# EAGLE design OptronV7_PCB (EAGLE 9.5.1)
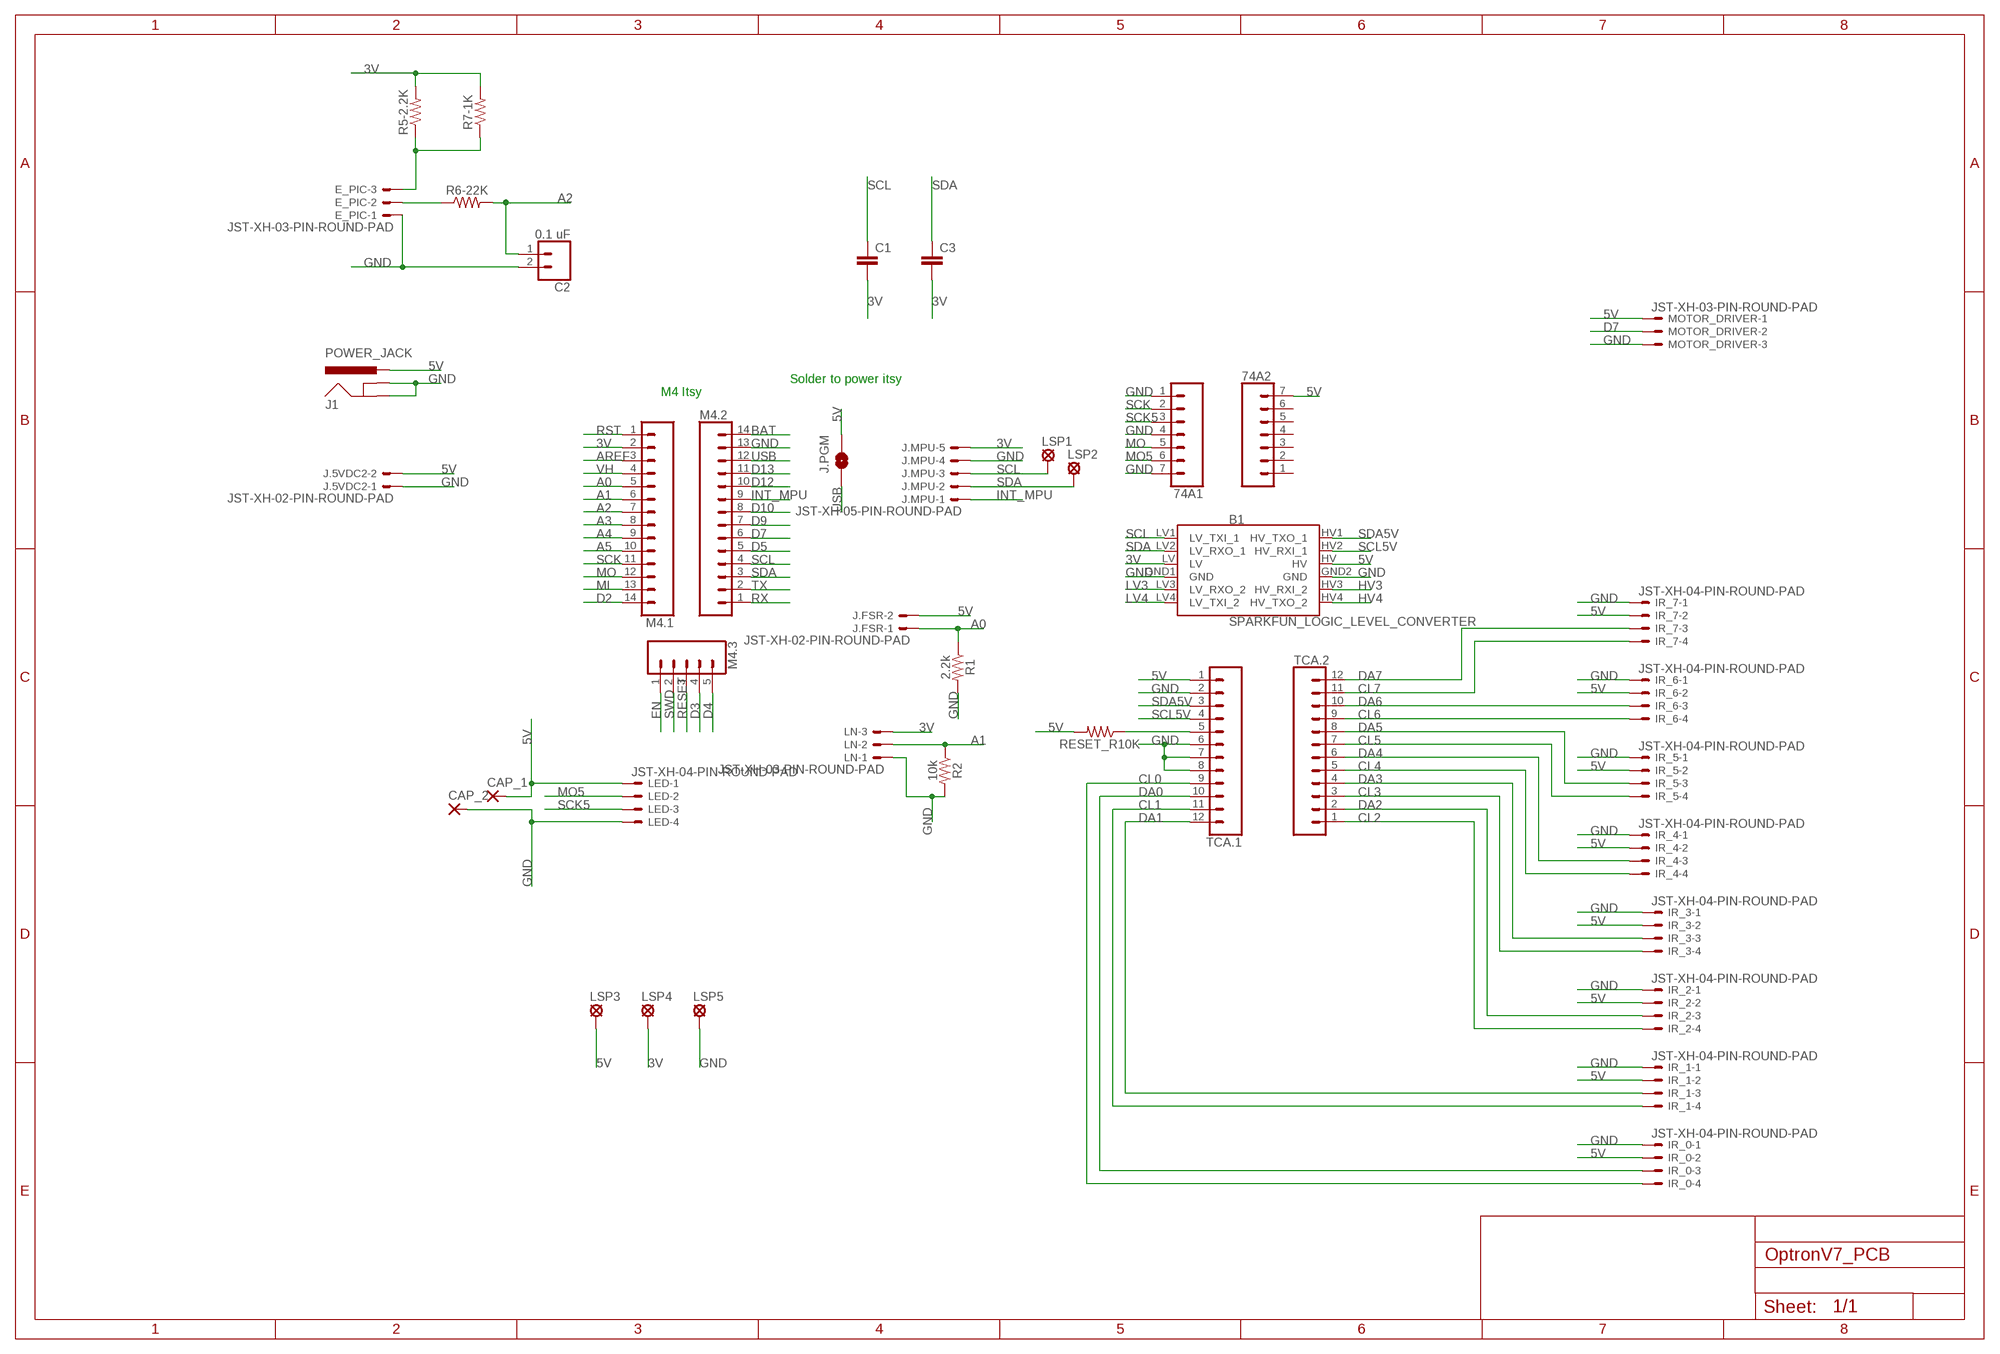
[diagram p0: schematic, sheet 1]

## Parts
74A1  CONN_07  [1X07]
74A2  CONN_07  [1X07]
B1  SPARKFUN_LOGIC_LEVEL_CONVERTER  [SPARKFUN_LOGIC_LEVEL_CONVERTER]
C1  C5/2.5  [C5B2.5]
C2  0.1 uF  CONN_02  [1X02]
C3  C5/2.5  [C5B2.5]
CAP_1  1,6/0,8  [1,6/0,8]
CAP_2  1,6/0,8  [1,6/0,8]
E_PIC  JST-XH-03-PIN-ROUND-PAD  [JST-XH-03-PACKAGE-ROUND-PAD]
IR_0  JST-XH-04-PIN-ROUND-PAD  [JST-XH-04-PACKAGE-ROUND-PAD]
IR_1  JST-XH-04-PIN-ROUND-PAD  [JST-XH-04-PACKAGE-ROUND-PAD]
IR_2  JST-XH-04-PIN-ROUND-PAD  [JST-XH-04-PACKAGE-ROUND-PAD]
IR_3  JST-XH-04-PIN-ROUND-PAD  [JST-XH-04-PACKAGE-ROUND-PAD]
IR_4  JST-XH-04-PIN-ROUND-PAD  [JST-XH-04-PACKAGE-ROUND-PAD]
IR_5  JST-XH-04-PIN-ROUND-PAD  [JST-XH-04-PACKAGE-ROUND-PAD]
IR_6  JST-XH-04-PIN-ROUND-PAD  [JST-XH-04-PACKAGE-ROUND-PAD]
IR_7  JST-XH-04-PIN-ROUND-PAD  [JST-XH-04-PACKAGE-ROUND-PAD]
J1  POWER_JACK  [POWER_JACK_PTH]
J.5VDC2  JST-XH-02-PIN-ROUND-PAD  [JST-XH-02-PACKAGE-ROUND-PAD]
J.FSR  JST-XH-02-PIN-ROUND-PAD  [JST-XH-02-PACKAGE-ROUND-PAD]
J.MPU  JST-XH-05-PIN-ROUND-PAD  [JST-XH-05-PACKAGE-ROUND-PAD]
J.PGM  JUMPER-SMT_2_NO_NO-SILK  [SMT-JUMPER_2_NO_NO-SILK]
LED  JST-XH-04-PIN-ROUND-PAD  [JST-XH-04-PACKAGE-ROUND-PAD]
LN  JST-XH-03-PIN-ROUND-PAD  [JST-XH-03-PACKAGE-ROUND-PAD]
LSP1  MCS08  [MCS08]
LSP2  MCS08  [MCS08]
LSP3  MCS08  [MCS08]
LSP4  MCS08  [MCS08]
LSP5  MCS08  [MCS08]
M4.1  CONN_14  [1X14]
M4.2  CONN_14  [1X14]
M4.3  CONN_05  [1X05]
MOTOR_DRIVER  JST-XH-03-PIN-ROUND-PAD  [JST-XH-03-PACKAGE-ROUND-PAD]
R1  2.2k  10KOHM-HORIZ-1/4W-5%  [AXIAL-0.3]
R2  10k  10KOHM-HORIZ-1/4W-5%  [AXIAL-0.3]
R5-2.2K  RESISTORAXIAL-0.3  [AXIAL-0.3]
R6-22K  RESISTORAXIAL-0.3  [AXIAL-0.3]
R7-1K  RESISTORAXIAL-0.3  [AXIAL-0.3]
RESET_R10K  RESISTORAXIAL-0.3  [AXIAL-0.3]
TCA.1  CONN_12  [1X12]
TCA.2  CONN_12  [1X12]

## Nets
3V: B1.LV C1.2 C3.2 J.MPU.5 LN.3 LSP4.MP M4.1.2 R5-2.2K.P$2 R7-1K.P$2
5V: 74A2.7 B1.HV CAP_1.1(P) IR_0.2 IR_1.2 IR_2.2 IR_3.2 IR_4.2 IR_5.2 IR_6.2 IR_7.2 J1.PWR J.5VDC2.2 J.FSR.2 J.PGM.2 LED.1 LSP3.MP MOTOR_DRIVER.1 RESET_R10K.P$2 TCA.1.1
A0: J.FSR.1 M4.1.5 R1.P$1
A1: LN.2 M4.1.6 R2.P$1
A2: C2.1 M4.1.7 R6-22K.P$2
A3: M4.1.8
A4: M4.1.9
A5: M4.1.10
AREF: M4.1.3
BAT: M4.2.14
CL0: IR_0.4 TCA.1.9
CL1: IR_1.4 TCA.1.11
CL2: IR_2.4 TCA.2.1
CL3: IR_3.4 TCA.2.3
CL4: IR_4.4 TCA.2.5
CL5: IR_5.4 TCA.2.7
CL6: IR_6.4 TCA.2.9
CL7: IR_7.4 TCA.2.11
D2: M4.1.14
D3: M4.3.4
D4: M4.3.5
D5: M4.2.5
D7: M4.2.6 MOTOR_DRIVER.2
D9: M4.2.7
D10: M4.2.8
D12: M4.2.10
D13: M4.2.11
DA0: IR_0.3 TCA.1.10
DA1: IR_1.3 TCA.1.12
DA2: IR_2.3 TCA.2.2
DA3: IR_3.3 TCA.2.4
DA4: IR_4.3 TCA.2.6
DA5: IR_5.3 TCA.2.8
DA6: IR_6.3 TCA.2.10
DA7: IR_7.3 TCA.2.12
EN: M4.3.1
GND: 74A1.1 74A1.4 74A1.7 B1.GND1(GND) B1.GND2(GND) C2.2 CAP_2.1(P) E_PIC.1 IR_0.1 IR_1.1 IR_2.1 IR_3.1 IR_4.1 IR_5.1 IR_6.1 IR_7.1 J1.GND J1.GNDBREAK J.5VDC2.1 J.MPU.4 LED.4 LN.1 LSP5.MP M4.2.13 MOTOR_DRIVER.3 R1.P$2 R2.P$2 TCA.1.2 TCA.1.6 TCA.1.7 TCA.1.8
HV3: B1.HV3(HV_RXI_2)
HV4: B1.HV4(HV_TXO_2)
INT_MPU: J.MPU.1 M4.2.9
LV3: B1.LV3(LV_RXO_2)
LV4: B1.LV4(LV_TXI_2)
MI: M4.1.13
MO: 74A1.5 M4.1.12
MO5: 74A1.6 LED.2
N$1: RESET_R10K.P$1 TCA.1.5
N$2: E_PIC.3 R5-2.2K.P$1 R7-1K.P$1
N$3: E_PIC.2 R6-22K.P$1
RESET: M4.3.3
RST: M4.1.1
RX: M4.2.1
SCK: 74A1.2 M4.1.11
SCK5: 74A1.3 LED.3
SCL: B1.LV1(LV_TXI_1) C1.1 J.MPU.3 LSP1.MP M4.2.4
SCL5V: B1.HV2(HV_RXI_1) TCA.1.4
SDA: B1.LV2(LV_RXO_1) C3.1 J.MPU.2 LSP2.MP M4.2.3
SDA5V: B1.HV1(HV_TXO_1) TCA.1.3
SWD: M4.3.2
TX: M4.2.2
USB: J.PGM.1 M4.2.12
VH: M4.1.4
Unconnected: 74A2.1 74A2.2 74A2.3 74A2.4 74A2.5 74A2.6

## Notes on the sheet
- Solder to power itsy
- M4 Itsy

## Library data of the parts
74A1 74A2 = SparkFun-Connectors:CONN_07: Multi connection point. Often used as Generic Header-pin footprint for 0.1 inch spaced/style header connections On any of the 0.1 inch spaced packages, you can populate with these: Break Away Headers - Straight <https://www.sparkfun.com/products/116> (PRT-00116) Break Away Male Headers - Right Angle <https://www.sparkfun.com/products/553> (PRT-00553) Female Headers <https://www.sparkfun.com/products/115> (PRT-00115) Break Away Headers - Machine Pin <https://www.sparkfun.com/products/117> (PRT-00117) Break Away Female Headers - Swiss Machine Pin <https://www.sparkfun.com/products/743> (PRT-00743) For SCREWTERMINALS and SPRING TERMINALS visit here: Screw Terimnals on SparkFun.com <https://www.sparkfun.com/search/results?term=Screw+Terminals> (5mm/3.5mm/2.54mm spacing) This device is also useful as a general connection point to wire up your design to another part of your project. Our various solder wires solder well into these plated through hole pads. Hook-Up Wire - Assortment (Stranded, 22 AWG) <https://www.sparkfun.com/products/11375> (PRT-11375) Hook-Up Wire - Assortment (Solid Core, 22 AWG) <https://www.sparkfun.com/products/11367> (PRT-11367) View the entire wire category on our website here <https://www.sparkfun.com/categories/141> Special notes: Molex polarized connector foot print use with SKU : PRT-08231 with associated crimp pins and housings. 1MM SMD Version SKU: PRT-10208 NOTES ON THE VARIANTS LOCK and LOCK_LONGPADS... This footprint was designed to help hold the alignment of a through-hole component (i.e. 6-pin header) while soldering it into place. You may notice that each hole has been shifted either up or down by 0.005 of an inch from it's more standard position (which is a perfectly straight line). This slight alteration caused the pins (the squares in the middle) to touch the edges of the holes. Because they are alternating, it causes a "brace" to hold the component in place. 0.005 has proven to be the perfect amount of "off-center" position when using our standard breakaway headers. Although looks a little odd when you look at the bare footprint, once you have a header in there, the alteration is very hard to notice. Also,if you push a header all the way into place, it is covered up entirely on the bottom side.
B1 = SparkFun-Boards:SPARKFUN_LOGIC_LEVEL_CONVERTER: SparkFun Logic Level Converter -Bi-Directional This is the mechnical outline for the 3.3V - 5V bi directional logic level converter. *Note, the "LOCK" Package has the header pins staggered by an offset of 5 mils (off center line), so that when you slide a row of standard 0.1" headers into the PTH pads, it will hold position vertically. See the follwing turorial for more information on this type of special footprints: Sneaky Footprints <https://www.sparkfun.com/tutorials/114> SparkFun Products: SparkFun Logic Level Converter - Bi-Directional <https://www.sparkfun.com/products/12009>
C1 C3 = capacitor-wima:C: CAPACITOR naming: grid - package width
C2 = SparkFun-Connectors:CONN_02: Multi connection point. Often used as Generic Header-pin footprint for 0.1 inch spaced/style header connections On any of the 0.1 inch spaced packages, you can populate with these: Break Away Headers - Straight <https://www.sparkfun.com/products/116> (PRT-00116) Break Away Male Headers - Right Angle <https://www.sparkfun.com/products/553> (PRT-00553) Female Headers <https://www.sparkfun.com/products/115> (PRT-00115) Break Away Headers - Machine Pin <https://www.sparkfun.com/products/117> (PRT-00117) Break Away Female Headers - Swiss Machine Pin <https://www.sparkfun.com/products/743> (PRT-00743) For SCREWTERMINALS and SPRING TERMINALS visit here: Screw Terimnals on SparkFun.com <https://www.sparkfun.com/search/results?term=Screw+Terminals> (5mm/3.5mm/2.54mm spacing) This device is also useful as a general connection point to wire up your design to another part of your project. Our various solder wires solder well into these plated through hole pads. Hook-Up Wire - Assortment (Stranded, 22 AWG) <https://www.sparkfun.com/products/11375> (PRT-11375) Hook-Up Wire - Assortment (Solid Core, 22 AWG) <https://www.sparkfun.com/products/11367> (PRT-11367) View the entire wire category on our website here <https://www.sparkfun.com/categories/141> Special notes: Molex polarized connector foot print use with: PRT-08233 with associated crimp pins and housings. 2.54_SCREWTERM for use with PRT-10571. 3.5mm Screw Terminal footprints for PRT-08084 5mm Screw Terminal footprints for use with PRT-08432
CAP_1 CAP_2 = wirepad:1,6/0,8: THROUGH-HOLE PAD
E_PIC LN MOTOR_DRIVER = Rembrandt Electronics - JST XH Connectors v1-0:JST-XH-03-PIN: JST XH Connector 2 Pin Wire to board connector. Pitch: 2,54 mm, (0.100") Number of pins: 3 Created by Rembrandt Electronics www.rembrandtelectronics.com
IR_0 IR_1-IR_7 LED = Rembrandt Electronics - JST XH Connectors v1-0:JST-XH-04-PIN: JST XH Connector 2 Pin Wire to board connector. Pitch: 2,54 mm, (0.100") Number of pins: 4 Created by Rembrandt Electronics www.rembrandtelectronics.com
J1 = SparkFun-Connectors:POWER_JACK: Power Jack Connector This is the standard 5.5mm barrel jack for power. The PTH is the most common, proven, reliable, footprint. The Slot footprint only works if the mill layer is transmitted to the PCB fab house so be warned. Here are the connectors we sell at SparkFun: DC Barrel Power Jack/Connector <https://www.sparkfun.com/products/119> (PRT-00119) DC Barrel Power Jack/Connector (SMD) <https://www.sparkfun.com/products/12748> (PRT-12748) DC Barrel Jack Adapter - Breadboard Compatible <https://www.sparkfun.com/products/10811> (PRT-10811) It is used on this SparkFun product (and many, many others): SparkFun RedBoard - Programmed with Arduino <https://www.sparkfun.com/products/12757> (DEV-12757) Also, if you need a mating power supply or connector, please check these out: Wall Adapter Power Supply - 9VDC 650mA <https://www.sparkfun.com/products/298> (TOL-00298) DC Barrel Jack Adapter - Male <https://www.sparkfun.com/products/10287> (PRT-10287); PROD_ID: CONN-08197
J.5VDC2 J.FSR = Rembrandt Electronics - JST XH Connectors v1-0:JST-XH-02-PIN: JST XH Connector 2 Pin Wire to board connector. Pitch: 2,54 mm, (0.100") Number of pins: 2 Created by Rembrandt Electronics www.rembrandtelectronics.com
J.MPU = Rembrandt Electronics - JST XH Connectors v1-0:JST-XH-05-PIN: JST XH Connector 2 Pin Wire to board connector. Pitch: 2,54 mm, (0.100") Number of pins: 5 Created by Rembrandt Electronics www.rembrandtelectronics.com
J.PGM = SparkFun-Jumpers:JUMPER-SMT_2_NO: Normally open jumper This jumper has two pads in close proximity to each other. Apply solder to close the connection. Round pads are easier to solder for beginners, but are a lot larger. SparkFun Product that uses the round pads: SparkFun EL Sequencer <https://www.sparkfun.com/products/12781>
LSP1-LSP5 = solpad:MCS08: SOLDER PAD MC S0,8, drill 1.2 mm, distributor Buerklin, 08F130
M4.1 M4.2 = SparkFun-Connectors:CONN_14: Multi connection point. Often used as Generic Header-pin footprint for 0.1 inch spaced/style header connections On any of the 0.1 inch spaced packages, you can populate with these: Break Away Headers - Straight <https://www.sparkfun.com/products/116> (PRT-00116) Break Away Male Headers - Right Angle <https://www.sparkfun.com/products/553> (PRT-00553) Female Headers <https://www.sparkfun.com/products/115> (PRT-00115) Break Away Headers - Machine Pin <https://www.sparkfun.com/products/117> (PRT-00117) Break Away Female Headers - Swiss Machine Pin <https://www.sparkfun.com/products/743> (PRT-00743) For SCREWTERMINALS and SPRING TERMINALS visit here: Screw Terimnals on SparkFun.com <https://www.sparkfun.com/search/results?term=Screw+Terminals> (5mm/3.5mm/2.54mm spacing) This device is also useful as a general connection point to wire up your design to another part of your project. Our various solder wires solder well into these plated through hole pads. Hook-Up Wire - Assortment (Stranded, 22 AWG) <https://www.sparkfun.com/products/11375> (PRT-11375) Hook-Up Wire - Assortment (Solid Core, 22 AWG) <https://www.sparkfun.com/products/11367> (PRT-11367) View the entire wire category on our website here <https://www.sparkfun.com/categories/141> Special notes: Molex polarized connector foot print use with SKU : PRT-08231 with associated crimp pins and housings. 1MM SMD Version SKU: PRT-10208 NOTES ON THE VARIANTS LOCK and LOCK_LONGPADS... This footprint was designed to help hold the alignment of a through-hole component (i.e. 6-pin header) while soldering it into place. You may notice that each hole has been shifted either up or down by 0.005 of an inch from it's more standard position (which is a perfectly straight line). This slight alteration caused the pins (the squares in the middle) to touch the edges of the holes. Because they are alternating, it causes a "brace" to hold the component in place. 0.005 has proven to be the perfect amount of "off-center" position when using our standard breakaway headers. Although looks a little odd when you look at the bare footprint, once you have a header in there, the alteration is very hard to notice. Also,if you push a header all the way into place, it is covered up entirely on the bottom side.
M4.3 = SparkFun-Connectors:CONN_05: Multi connection point. Often used as Generic Header-pin footprint for 0.1 inch spaced/style header connections On any of the 0.1 inch spaced packages, you can populate with these: Break Away Headers - Straight <https://www.sparkfun.com/products/116> (PRT-00116) Break Away Male Headers - Right Angle <https://www.sparkfun.com/products/553> (PRT-00553) Female Headers <https://www.sparkfun.com/products/115> (PRT-00115) Break Away Headers - Machine Pin <https://www.sparkfun.com/products/117> (PRT-00117) Break Away Female Headers - Swiss Machine Pin <https://www.sparkfun.com/products/743> (PRT-00743) For SCREWTERMINALS and SPRING TERMINALS visit here: Screw Terimnals on SparkFun.com <https://www.sparkfun.com/search/results?term=Screw+Terminals> (5mm/3.5mm/2.54mm spacing) This device is also useful as a general connection point to wire up your design to another part of your project. Our various solder wires solder well into these plated through hole pads. Hook-Up Wire - Assortment (Stranded, 22 AWG) <https://www.sparkfun.com/products/11375> (PRT-11375) Hook-Up Wire - Assortment (Solid Core, 22 AWG) <https://www.sparkfun.com/products/11367> (PRT-11367) View the entire wire category on our website here <https://www.sparkfun.com/categories/141> Special notes: Molex polarized connector foot print use with SKU : PRT-08231 with associated crimp pins and housings. 1MM SMD Version SKU: PRT-10208
R1 = SparkFun-Resistors:10KOHM: 10kΩ resistor A resistor is a passive two-terminal electrical component that implements electrical resistance as a circuit element. Resistors act to reduce current flow, and, at the same time, act to lower voltage levels within circuits. - Wikipedia; PROD_ID: RES-09435; VALUE: 10k
R2 = SparkFun-Resistors:10KOHM: 10kΩ resistor A resistor is a passive two-terminal electrical component that implements electrical resistance as a circuit element. Resistors act to reduce current flow, and, at the same time, act to lower voltage levels within circuits. - Wikipedia; PROD_ID: RES-09435
R5-2.2K R6-22K R7-1K RESET_R10K = SparkFun-Resistors:RESISTOR: Generic Resistor Package
TCA.1 TCA.2 = SparkFun-Connectors:CONN_12: Multi connection point. Often used as Generic Header-pin footprint for 0.1 inch spaced/style header connections On any of the 0.1 inch spaced packages, you can populate with these: Break Away Headers - Straight <https://www.sparkfun.com/products/116> (PRT-00116) Break Away Male Headers - Right Angle <https://www.sparkfun.com/products/553> (PRT-00553) Female Headers <https://www.sparkfun.com/products/115> (PRT-00115) Break Away Headers - Machine Pin <https://www.sparkfun.com/products/117> (PRT-00117) Break Away Female Headers - Swiss Machine Pin <https://www.sparkfun.com/products/743> (PRT-00743) For SCREWTERMINALS and SPRING TERMINALS visit here: Screw Terimnals on SparkFun.com <https://www.sparkfun.com/search/results?term=Screw+Terminals> (5mm/3.5mm/2.54mm spacing) This device is also useful as a general connection point to wire up your design to another part of your project. Our various solder wires solder well into these plated through hole pads. Hook-Up Wire - Assortment (Stranded, 22 AWG) <https://www.sparkfun.com/products/11375> (PRT-11375) Hook-Up Wire - Assortment (Solid Core, 22 AWG) <https://www.sparkfun.com/products/11367> (PRT-11367) View the entire wire category on our website here <https://www.sparkfun.com/categories/141> Special notes: Molex polarized connector foot print use with SKU : PRT-08231 with associated crimp pins and housings. 1MM SMD Version SKU: PRT-10208 NOTES ON THE VARIANTS LOCK and LOCK_LONGPADS... This footprint was designed to help hold the alignment of a through-hole component (i.e. 6-pin header) while soldering it into place. You may notice that each hole has been shifted either up or down by 0.005 of an inch from it's more standard position (which is a perfectly straight line). This slight alteration caused the pins (the squares in the middle) to touch the edges of the holes. Because they are alternating, it causes a "brace" to hold the component in place. 0.005 has proven to be the perfect amount of "off-center" position when using our standard breakaway headers. Although looks a little odd when you look at the bare footprint, once you have a header in there, the alteration is very hard to notice. Also,if you push a header all the way into place, it is covered up entirely on the bottom side.

## Board
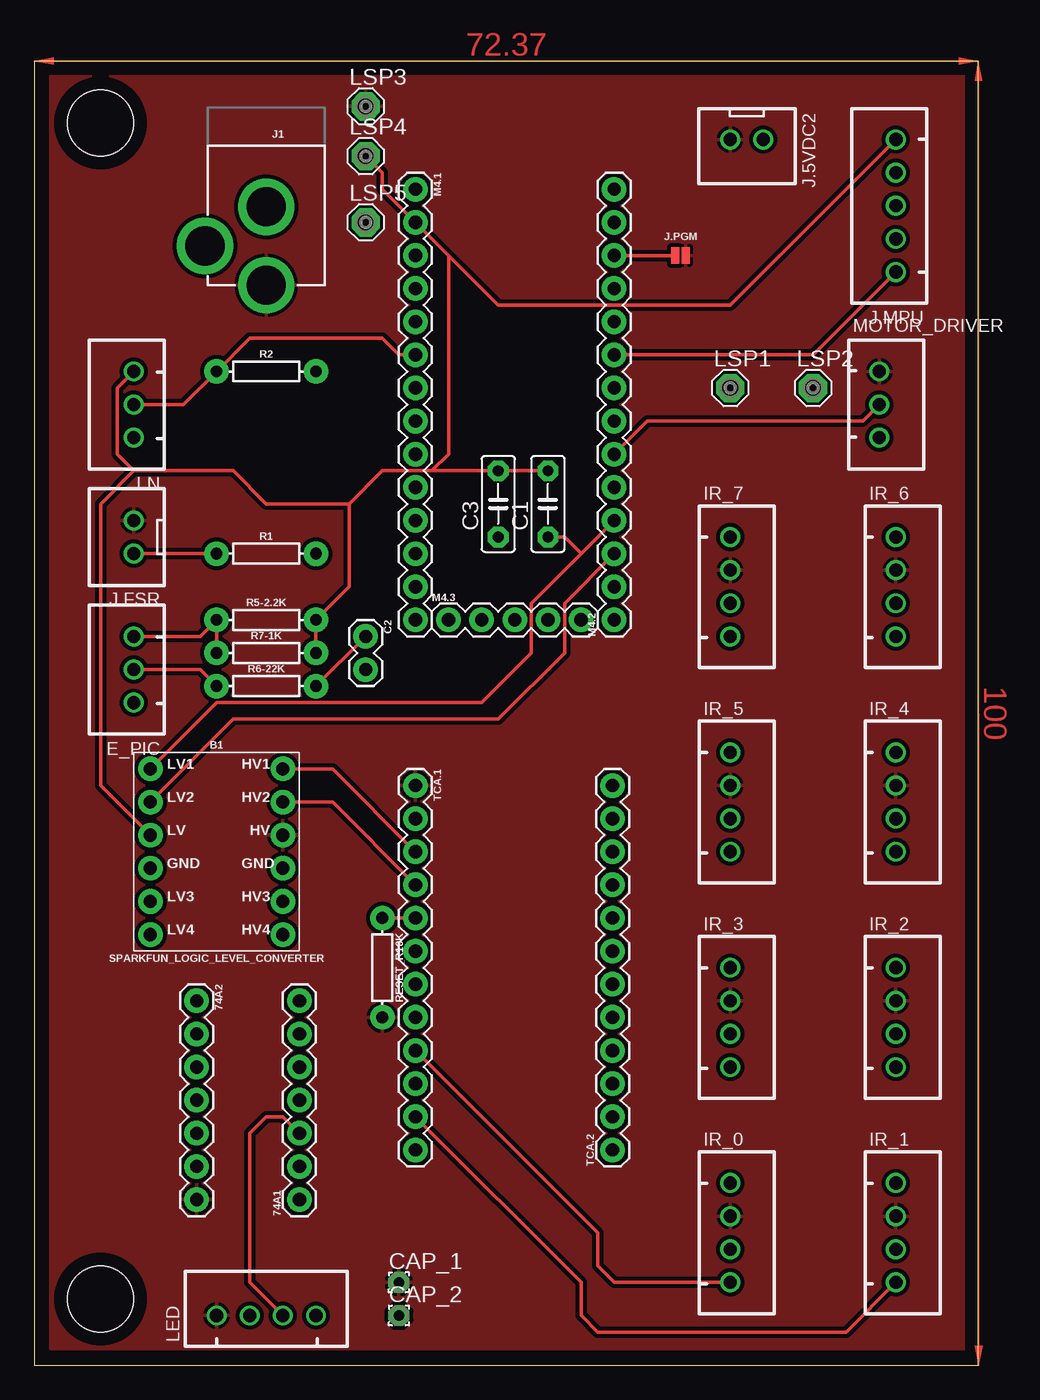
[diagram p1: board, top side]
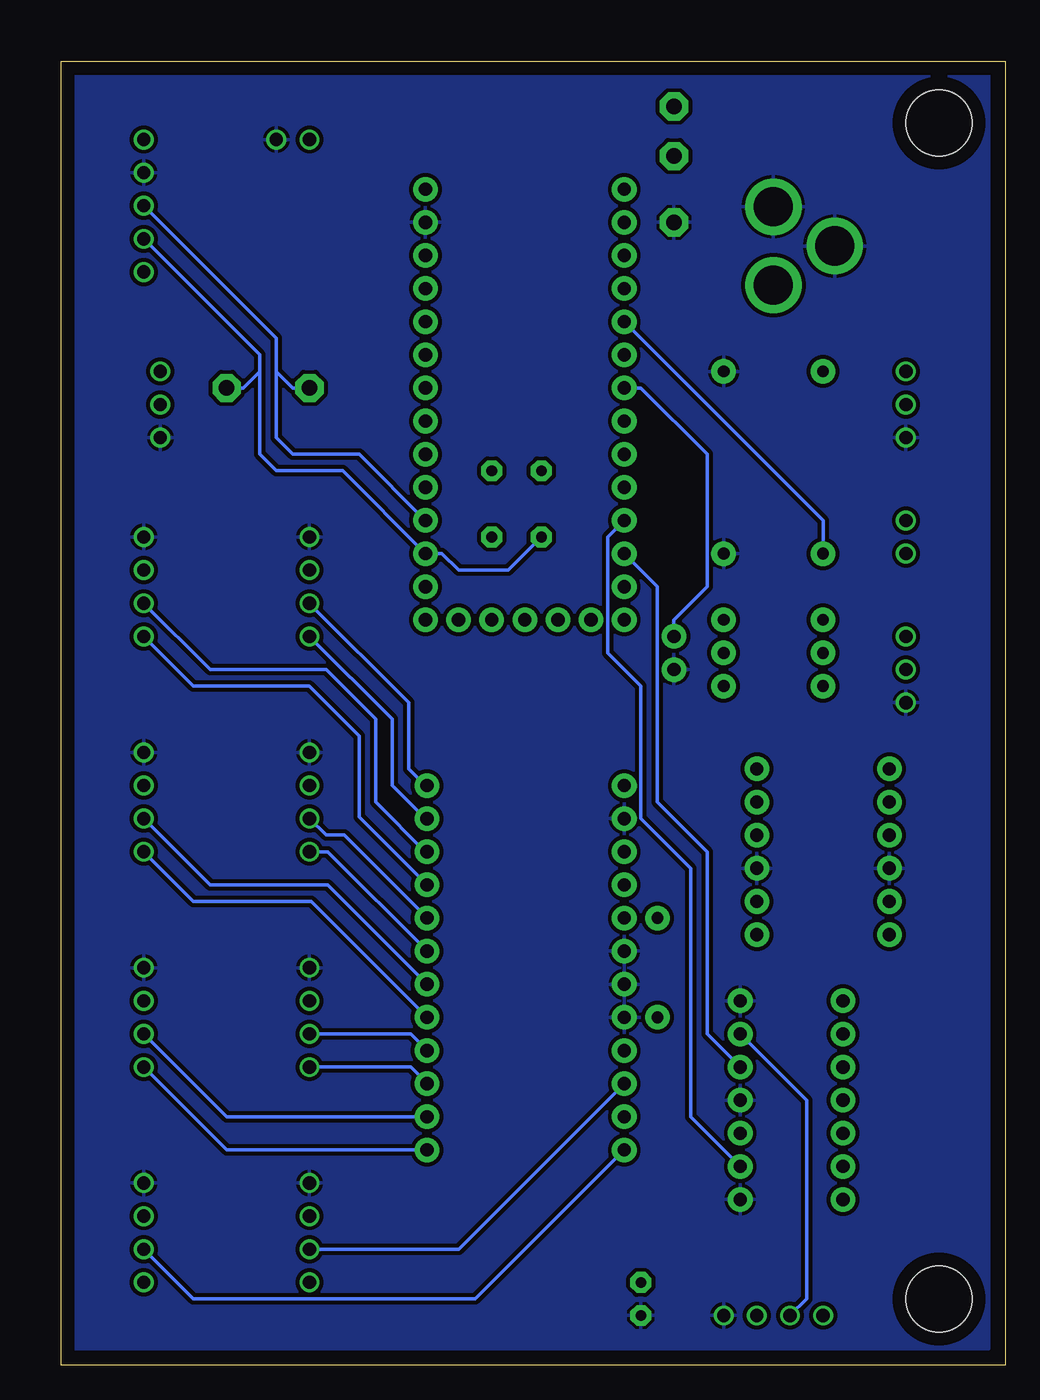
[diagram p2: board, bottom side, seen from below]

Size 72.37 x 100 mm. Coordinates in mm from the lower left corner, seen from the top.
Outline: 0,0 72.37,0 72.37,100 0,100 0,0
Copper layers (1*16): Top 0.035mm / dielectric 1.5mm / Bottom 0.035mm
Design rules "default": minimum track width 6mil, minimum drill 0.35mm, track to track 6mil, track to pad 6mil, pad to pad 6mil, via to via 6mil, smd to smd 6mil, copper to edge 40mil, drill to drill 6mil, minimum pad ring 10mil, minimum via ring 8mil, stop-mask expansion 4mil, vias tented up to drill 0mil, thermal gap 10mil
Holes 5.08 mm at 5.08,5.08 5.08,95.25

### Footprints (pad centres in the part's own frame; a part is rotated, then mirrored left to right if it is on the bottom)
1X07 = drill 1.016 pad 1.88: 1 0,0; 2 2.54,0; 3 5.08,0; 4 7.62,0; 5 10.16,0; 6 12.7,0; 7 15.24,0
SPARKFUN_LOGIC_LEVEL_CONVERTER = drill 1.016 pad 1.88: GND1 -5.08,-1.27; GND2 5.08,-1.27; HV 5.08,1.27; HV1 5.08,6.35; HV2 5.08,3.81; HV3 5.08,-3.81; HV4 5.08,-6.35; LV -5.08,1.27; LV1 -5.08,6.35; LV2 -5.08,3.81; LV3 -5.08,-3.81; LV4 -5.08,-6.35
C5B2.5 = drill 0.813 pad 1.6 octagon: 1 -2.54,0; 2 2.54,0
1X02 = drill 1.016 pad 1.88: 1 0,0; 2 2.54,0
1,6/0,8 = drill 0.813 pad 1.6 octagon: 1 0,0
JST-XH-03-PACKAGE-ROUND-PAD = drill 1.016: 1 -2.54,0; 2 0,0; 3 2.54,0
JST-XH-04-PACKAGE-ROUND-PAD = drill 1.016: 1 -3.81,0; 2 -1.27,0; 3 1.27,0; 4 3.81,0
POWER_JACK_PTH = drill 2.997 pad 4.318: GND 0,7.7; GNDBREAK 4.7,10.7; PWR 0,13.7
JST-XH-02-PACKAGE-ROUND-PAD = drill 1.016: 1 -1.27,0; 2 1.27,0
JST-XH-05-PACKAGE-ROUND-PAD = drill 1.016: 1 -5.08,0; 2 -2.54,0; 3 0,0; 4 2.54,0; 5 5.08,0
SMT-JUMPER_2_NO_NO-SILK = smd 0.635 x 1.27: 1 -0.406,0; 2 0.406,0
MCS08 = drill 1.194 pad 2.159 octagon: MP 0,0
1X14 = drill 1.016 pad 1.88: 1 0,0; 2 2.54,0; 3 5.08,0; 4 7.62,0; 5 10.16,0; 6 12.7,0; 7 15.24,0; 8 17.78,0; 9 20.32,0; 10 22.86,0; 11 25.4,0; 12 27.94,0; 13 30.48,0; 14 33.02,0
1X05 = drill 1.016 pad 1.88: 1 0,0; 2 2.54,0; 3 5.08,0; 4 7.62,0; 5 10.16,0
AXIAL-0.3 = drill 0.9 pad 1.88: P$1 -3.81,0; P$2 3.81,0
1X12 = drill 1.016 pad 1.88: 1 0,0; 2 2.54,0; 3 5.08,0; 4 7.62,0; 5 10.16,0; 6 12.7,0; 7 15.24,0; 8 17.78,0; 9 20.32,0; 10 22.86,0; 11 25.4,0; 12 27.94,0

### Placement (x,y rotation side)
74A1  20.32,12.7 90 top
74A2  12.45,27.94 270 top
B1  13.97,39.37 0 top
C1  39.37,66.04 90 top
C2  25.4,55.88 270 top
C3  35.56,66.04 90 top
CAP_1  27.94,6.35 0 top
CAP_2  27.94,3.81 0 top
E_PIC  7.62,53.34 90 top
IR_0  53.34,10.16 270 top
IR_1  66.04,10.16 270 top
IR_2  66.04,26.67 270 top
IR_3  53.34,26.67 270 top
IR_4  66.04,43.18 270 top
IR_5  53.34,43.18 270 top
IR_6  66.04,59.69 270 top
IR_7  53.34,59.69 270 top
J1  17.78,96.52 180 top
J.5VDC2  54.61,93.98 180 top
J.FSR  7.62,63.5 90 top
J.MPU  66.04,88.9 90 top
J.PGM  49.53,85.09 0 top
LED  17.78,3.81 0 top
LN  7.62,73.66 90 top
LSP1  53.34,74.93 0 top
LSP2  59.69,74.93 0 top
LSP3  25.4,96.52 0 top
LSP4  25.4,92.71 0 top
LSP5  25.4,87.63 0 top
M4.1  29.21,90.17 270 top
M4.2  44.45,57.15 90 top
M4.3  31.75,57.15 0 top
MOTOR_DRIVER  64.77,73.66 270 top
R1  17.78,62.23 0 top
R2  17.78,76.2 0 top
R5-2.2K  17.78,57.15 0 top
R6-22K  17.78,52.07 0 top
R7-1K  17.78,54.61 0 top
RESET_R10K  26.67,30.48 270 top
TCA.1  29.21,44.45 270 top
TCA.2  44.32,16.51 90 top

### Tracks (layer width: path | path; a pad name or v marks a point on that pad's centre or on a via)
3V
  Top 0.152: M4.1.2 31.75,85.09
  Top 0.254: 31.75,85.09 31.75,69.85 30.48,68.58 | 30.48,68.58 26.67,68.58 24.13,66.04 | 24.13,66.04 24.13,59.69 R5-2.2K.P$2 R7-1K.P$2 | 24.13,66.04 17.78,66.04 15.24,68.58 7.62,68.58 | B1.LV 5.08,44.45 5.08,66.04 7.62,68.58 | J.MPU.5 53.34,81.28 35.56,81.28 M4.1.2 26.67,90.17 26.67,91.44 LSP4.MP | 30.48,68.58 C3.2 C1.2 | 7.62,68.58 6.35,69.85 6.35,74.93 LN.3
5V
  pour Top (isolate 0.305): 1.27,99.06 72.39,99.06 72.39,1.27 1.27,1.27
A0
  Top 0.254: J.FSR.1 R1.P$1
  Bottom 0.254: R1.P$1 13.97,64.77 M4.1.5
A1
  Top 0.254: LN.2 11.43,73.66 R2.P$1 16.51,78.74 26.67,78.74 27.94,77.47 M4.1.6
A2
  Top 0.254: R6-22K.P$2 C2.1
  Bottom 0.254: C2.1 25.4,57.15 22.86,59.69 22.86,69.85 27.94,74.93 M4.1.7
CL0
  Top 0.254: IR_0.4 44.45,6.35 43.18,7.62 43.18,10.16 TCA.1.9
CL1
  Top 0.254: IR_1.4 62.23,2.54 43.18,2.54 41.91,3.81 41.91,6.35 TCA.1.11
CL2
  Bottom 0.254: IR_2.4 59.69,16.51 TCA.2.1
CL3
  Bottom 0.254: TCA.2.3 45.59,22.86 IR_3.4
CL4
  Bottom 0.254: IR_4.4 62.23,35.56 53.21,35.56 TCA.2.5
CL5
  Bottom 0.254: TCA.2.7 51.94,39.37 IR_5.4
CL6
  Bottom 0.254: IR_6.4 62.23,52.07 53.34,52.07 49.53,48.26 49.53,42.04 TCA.2.9
CL7
  Bottom 0.152: 44.45,41.91 TCA.2.11
  Bottom 0.254: IR_7.4 46.99,49.53 46.99,44.45 44.45,41.91
D7
  Top 0.254: MOTOR_DRIVER.2 63.5,72.39 46.99,72.39 M4.2.6
DA0
  Bottom 0.254: IR_0.3 41.91,8.89 TCA.1.10
DA1
  Bottom 0.254: IR_1.3 62.23,5.08 40.64,5.08 TCA.1.12
DA2
  Bottom 0.254: IR_2.3 59.69,19.05 TCA.2.2
DA3
  Bottom 0.254: TCA.2.4 45.59,25.4 IR_3.3
DA4
  Bottom 0.254: IR_4.3 60.96,36.83 51.94,36.83 TCA.2.6
DA5
  Bottom 0.254: IR_5.3 52.07,40.64 50.67,40.64 TCA.2.8
DA6
  Bottom 0.152: 44.45,39.37 TCA.2.10
  Bottom 0.254: IR_6.3 60.96,53.34 52.07,53.34 48.26,49.53 48.26,43.18 44.45,39.37
DA7
  Bottom 0.152: 44.45,44.45 TCA.2.12
  Bottom 0.254: IR_7.3 45.72,50.8 45.72,45.72 44.45,44.45
GND
  pour Bottom (isolate 0.305): 1.27,99.06 72.39,99.06 72.39,1.27 1.27,1.27
INT_MPU
  Top 0.254: J.MPU.1 59.69,77.47 M4.2.9
MO
  Bottom 0.254: 74A1.5 22.86,25.4 22.86,39.37 26.67,43.18 26.67,59.69 M4.1.12
MO5
  Bottom 0.254: LED.2 15.24,5.08 15.24,20.32 74A1.6
N$1
  Top 0.254: TCA.1.5 RESET_R10K.P$1
N$2
  Top 0.254: R7-1K.P$1 R5-2.2K.P$1 12.7,55.88 E_PIC.3
N$3
  Top 0.254: E_PIC.2 12.7,53.34 R6-22K.P$1
SCK
  Bottom 0.254: M4.1.11 30.48,63.5 30.48,54.61 27.94,52.07 27.94,41.91 24.13,38.1 24.13,19.05 74A1.2
SCK5
  Top 0.254: LED.3 17.78,5.08 16.51,6.35 16.51,17.78 17.78,19.05 19.05,19.05 74A1.3
SCL
  Top 0.254: M4.2.4 41.91,62.23 | 41.91,62.23 38.1,58.42 38.1,54.61 34.29,50.8 13.97,50.8 B1.LV1 | 41.91,62.23 40.64,63.5 C1.1
  Bottom 0.254: M4.2.4 49.53,69.85 54.61,69.85 55.88,71.12 55.88,76.2 | 55.88,76.2 55.88,78.74 J.MPU.3 | 55.88,76.2 54.61,74.93 LSP1.MP
SCL5V
  Top 0.254: TCA.1.4 22.86,43.18 B1.HV2
SDA
  Top 0.254: B1.LV2 15.24,49.53 35.56,49.53 40.64,54.61 40.64,58.42 M4.2.3
  Bottom 0.254: 57.15,76.2 57.15,77.47 J.MPU.2 | 57.15,76.2 57.15,69.85 55.88,68.58 50.8,68.58 M4.2.3 43.18,62.23 41.91,60.96 38.1,60.96 C3.1 | 57.15,76.2 58.42,74.93 LSP2.MP
SDA5V
  Top 0.254: TCA.1.3 22.86,45.72 B1.HV1
USB
  Top 0.254: J.PGM.1 M4.2.12
(copper drawn outside any net)
  shapes: Top area x2